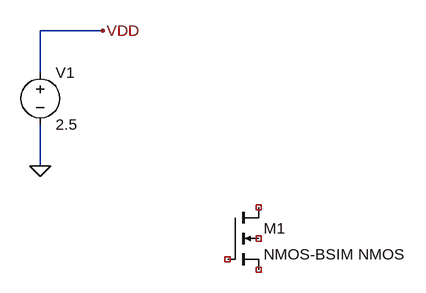
[diagram p0: schematic NMOS_CG.asc]
NMOS_CG.asc, the LTspice schematic file:
Version 4.1
SHEET 1 880 680
WIRE -240 -336 -336 -336
WIRE -336 -272 -336 -336
WIRE -336 -128 -336 -192
FLAG -336 -128 0
FLAG -240 -336 VDD
SYMBOL voltage -336 -288 R0
WINDOW 123 0 0 Left 0
WINDOW 39 0 0 Left 0
SYMATTR InstName V1
SYMATTR Value 2.5
SYMBOL nmos4 -48 -64 R0
SYMATTR InstName M1
SYMATTR Value NMOS-BSIM NMOS

The netlist it stands for:
* NMOS_CG.asc
V1 VDD 0 2.5
M1 NC_01 NC_02 NC_03 NC_04 NMOS-BSIM NMOS
.model NMOS NMOS
.model PMOS PMOS
.lib standard.mos
.backanno
.end